# Altium schematic sheet miniPCIE_Arria10.SchDoc: miniPCIE Arria10
size B; DocumentNumber: 23; SheetNumber: 23; SheetTotal: 46
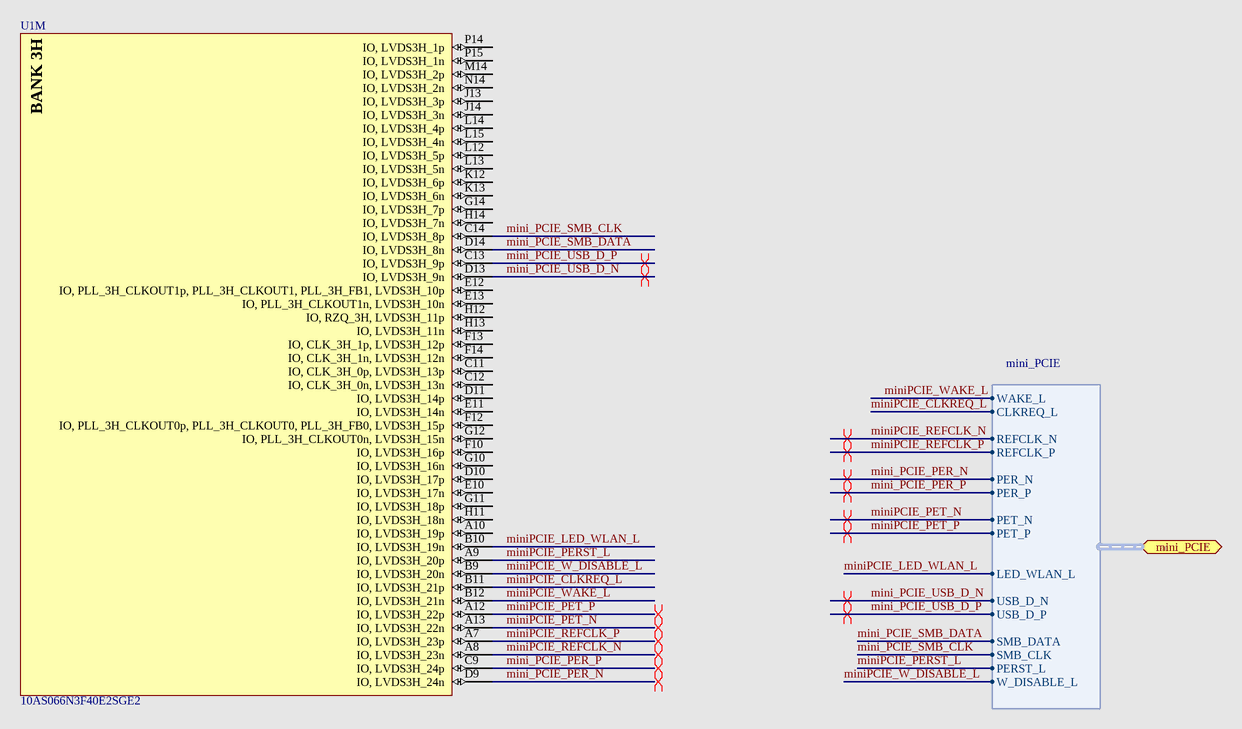
[diagram p0: miniPCIE_Arria10.SchDoc]

## Parts
U1  10AS066N3F40E2SGE2  [ALTR-FBGA1517_A-350]  (part M of 31)

## Ports
mini_PCIE (harness mini_PCIE)

## Harnesses
mini_PCIE: WAKE_L, CLKREQ_L, REFCLK_N, REFCLK_P, PER_N, PER_P, PET_N, PET_P, LED_WLAN_L, USB_D_N, USB_D_P, SMB_DATA, SMB_CLK, PERST_L, W_DISABLE_L

## Nets
mini_PCIE_PER_N: U1.D9(IO,_LVDS3H_24n) ; port mini_PCIE.PER_N
mini_PCIE_PER_P: U1.C9(IO,_LVDS3H_24p) ; port mini_PCIE.PER_P
mini_PCIE_SMB_CLK: U1.C14(IO,_LVDS3H_8p) ; port mini_PCIE.SMB_CLK
mini_PCIE_SMB_DATA: U1.D14(IO,_LVDS3H_8n) ; port mini_PCIE.SMB_DATA
mini_PCIE_USB_D_N: U1.D13(IO,_LVDS3H_9n) ; port mini_PCIE.USB_D_N
mini_PCIE_USB_D_P: U1.C13(IO,_LVDS3H_9p) ; port mini_PCIE.USB_D_P
miniPCIE_CLKREQ_L: U1.B11(IO,_LVDS3H_21p) ; port mini_PCIE.CLKREQ_L
miniPCIE_LED_WLAN_L: U1.B10(IO,_LVDS3H_19n) ; port mini_PCIE.LED_WLAN_L
miniPCIE_PERST_L: U1.A9(IO,_LVDS3H_20p) ; port mini_PCIE.PERST_L
miniPCIE_PET_N: U1.A13(IO,_LVDS3H_22n) ; port mini_PCIE.PET_N
miniPCIE_PET_P: U1.A12(IO,_LVDS3H_22p) ; port mini_PCIE.PET_P
miniPCIE_REFCLK_N: U1.A8(IO,_LVDS3H_23n) ; port mini_PCIE.REFCLK_N
miniPCIE_REFCLK_P: U1.A7(IO,_LVDS3H_23p) ; port mini_PCIE.REFCLK_P
miniPCIE_W_DISABLE_L: U1.B9(IO,_LVDS3H_20n) ; port mini_PCIE.W_DISABLE_L
miniPCIE_WAKE_L: U1.B12(IO,_LVDS3H_21n) ; port mini_PCIE.WAKE_L

Not connected (* = marked no-connect by the designer): U1 A10(IO,_LVDS3H_19p) C11(IO,_CLK_3H_0p,_LVDS3H_13p) C12(IO,_CLK_3H_0n,_LVDS3H_13n) D10(IO,_LVDS3H_17p) D11(IO,_LVDS3H_14p) E10(IO,_LVDS3H_17n) E11(IO,_LVDS3H_14n) E12(IO,_PLL_3H_CLKOUT1p,_PLL_3H_CLKOUT1,_PLL_3H_FB1,_LVDS3H_10p) E13(IO,_PLL_3H_CLKOUT1n,_LVDS3H_10n) F10(IO,_LVDS3H_16p) F12(IO,_PLL_3H_CLKOUT0p,_PLL_3H_CLKOUT0,_PLL_3H_FB0,_LVDS3H_15p) F13(IO,_CLK_3H_1p,_LVDS3H_12p) F14(IO,_CLK_3H_1n,_LVDS3H_12n) G10(IO,_LVDS3H_16n) G11(IO,_LVDS3H_18p) G12(IO,_PLL_3H_CLKOUT0n,_LVDS3H_15n) G14(IO,_LVDS3H_7p) H11(IO,_LVDS3H_18n) H12(IO,_RZQ_3H,_LVDS3H_11p) H13(IO,_LVDS3H_11n) H14(IO,_LVDS3H_7n) J13(IO,_LVDS3H_3p) J14(IO,_LVDS3H_3n) K12(IO,_LVDS3H_6p) K13(IO,_LVDS3H_6n) L12(IO,_LVDS3H_5p) L13(IO,_LVDS3H_5n) L14(IO,_LVDS3H_4p) L15(IO,_LVDS3H_4n) M14(IO,_LVDS3H_2p) N14(IO,_LVDS3H_2n) P14(IO,_LVDS3H_1p) P15(IO,_LVDS3H_1n)

## Layout directives
differential pair: mini_PCIE_PER_N, mini_PCIE_PER_P, mini_PCIE_USB_D_N, mini_PCIE_USB_D_P, miniPCIE_PET_N, miniPCIE_PET_P, miniPCIE_REFCLK_N, miniPCIE_REFCLK_P

## Notes on the sheet
- Title
- Size:
- Date:
- B
- Number:
- Time:
- Revision:
- Sheet
- of
- File:
- (in symbol CMP-1689-00006-3, part M) BANK 3H

## Library data of the parts
U1 = CMP-1689-00006-3: Arria 10 SX Family, 588 I/O Pins, 16 Fractional PLLs, 1517-Pin FBGA, Speed Grade 2, Extended Grade, RoHS; ComponentLink3Description: Package Specification; PackageVersion: Rev. 5.0, 01/2016; ComponentLink3URL: https://www.altera.com/content/dam/altera-www/global/en_US/pdfs/literature/packaging/04r00461-04.pdf; ComponentLink2Description: Datasheet; Code_JEDEC: MS-034; Mounting Technology: Surface Mount; PartNumber: 10AS066N3F40E2SGE2; PackageDescription: 1517-Pin FineLine Ball-Grid Array (FBGA), Body 40 x 40 mm, Pitch 1 mm; ComponentLink2URL: https://www.altera.com/content/dam/altera-www/global/en_US/pdfs/literature/hb/arria-10/a10_datasheet.pdf; ComponentLink1URL: https://www.altera.com/; DatasheetVersion: Rev. 2016-06-24, 06/2016; ComponentLink1Description: Manufacturer URL